# Altium project EL-04 Data Logger.PrjPcb
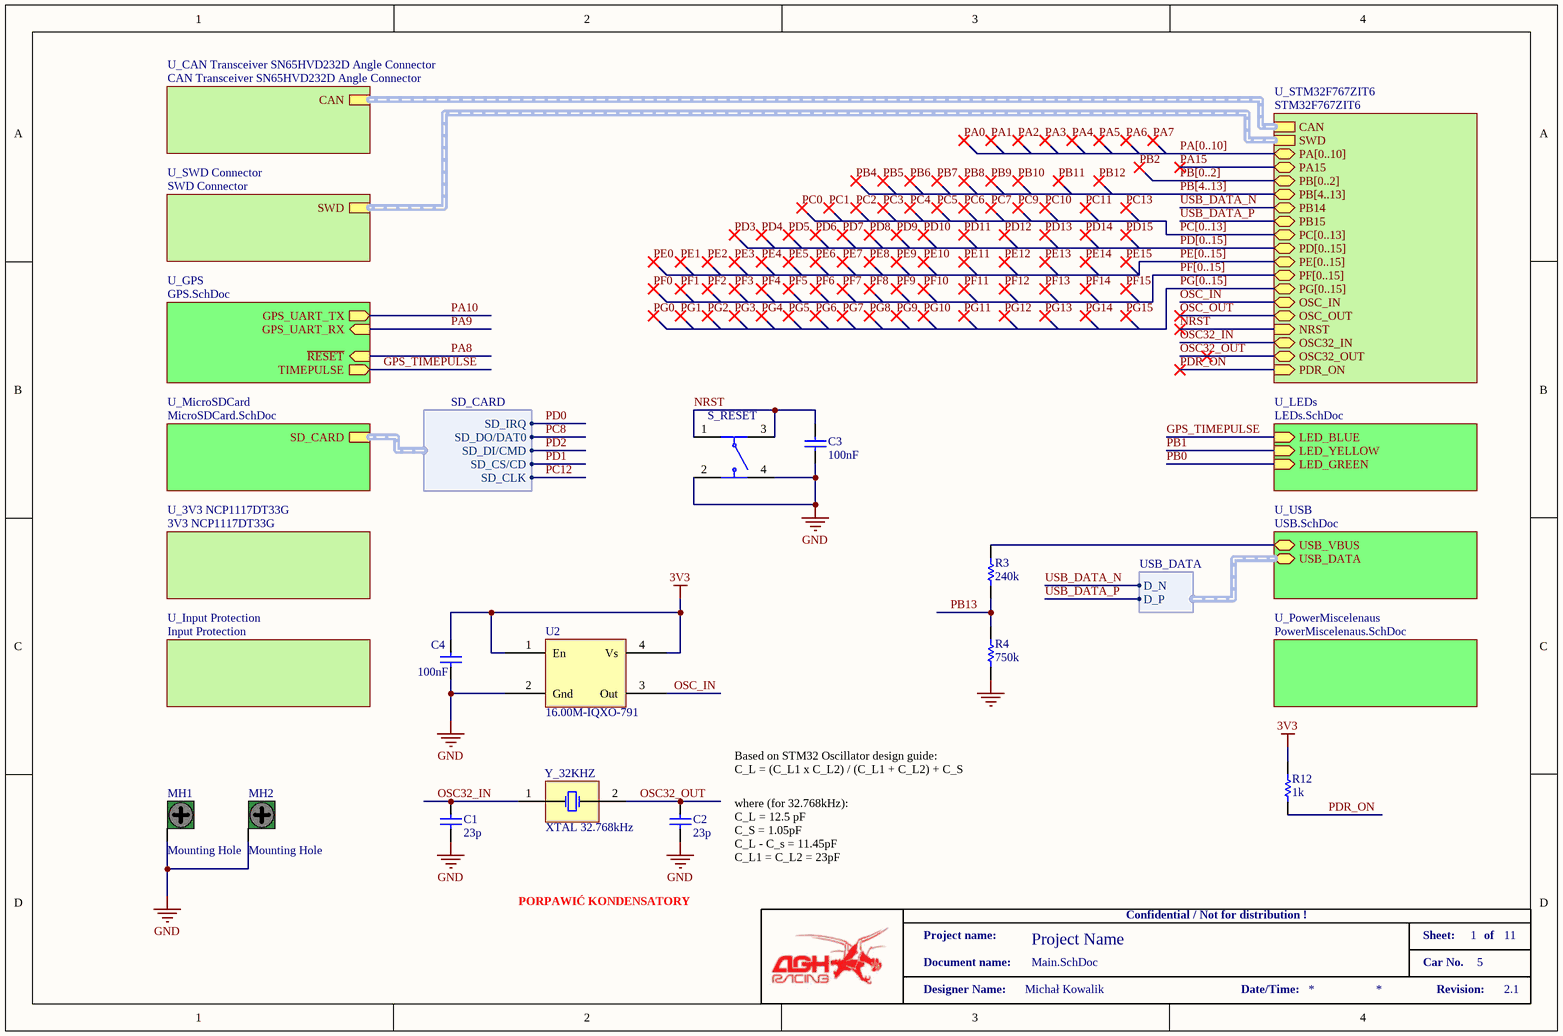
[diagram p0: Main.SchDoc]
3 sheets, 26 parts. Net scope: hierarchical (ports join the sheet entries above them; power ports are global).
Board file: PCB1.PcbDoc
Sheets:
  Main.SchDoc
    U_GPS = GPS.SchDoc
    U_MicroSDCard = MicroSDCard.SchDoc

## Sheet Main.SchDoc
size A4; Author: Michał Kowalik; CompanyName: AGH Racing; DocumentNumber: 1; Revision: 2.1; SheetNumber: 1; SheetTotal: 11; CarNumber: 5; ProjectName: Project Name

### Parts
C1  value 23p  [CAP_0603_IPC_MD]  (hidden comment: Cap)
C2  value 23p  [CAP_0603_IPC_MD]  (hidden comment: Cap)
C3  value 100nF  [CAP_0603_IPC_MD]  (hidden comment: Cap)
C4  value 100nF  [CAP_0603_IPC_MD]  (hidden comment: Cap)
MH1  Mounting Hole  [MOUNTING HOLE 2mm]  (no BOM)
MH2  Mounting Hole  [MOUNTING HOLE 2mm]  (no BOM)
R3  value 240k  [RES_0603_IPC_MD]  (hidden comment: Res)
R4  value 750k  [RES_0603_IPC_MD]  (hidden comment: Res)
R12  value 1k  [RES_0603_IPC_MD]  (hidden comment: Res)
S_RESET  Switch  [Microswitch_SMD_4_3mm]  (value not drawn)
U2  16.00M-IQXO-791  [ICLCX18]
Y_32KHZ  XTAL 32.768kHz  [XTAL 32.768kHz IQD Frequencies]

### Sub-sheets
U_3V3 NCP1117DT33G = 3V3 NCP1117DT33G (file not in this document): no entries
U_CAN Transceiver SN65HVD232D Angle Connector = CAN Transceiver SN65HVD232D Angle Connector (file not in this document): CAN (harness CAN)
U_GPS = GPS.SchDoc: ~{RESET} (in), TIMEPULSE (out), GPS_UART_RX (in), GPS_UART_TX (out)
U_Input Protection = Input Protection (file not in this document): no entries
U_LEDs = LEDs.SchDoc (file not in this document): LED_BLUE (in), LED_YELLOW (in), LED_GREEN (in)
U_MicroSDCard = MicroSDCard.SchDoc: SD_CARD (harness SD_CARD)
U_PowerMiscelenaus = PowerMiscelenaus.SchDoc (file not in this document): no entries
U_STM32F767ZIT6 = STM32F767ZIT6 (file not in this document): CAN (harness CAN), SWD (harness SWD), PB[0..2] (bidir), PB[4..13] (bidir), PC[0..13] (bidir), PA15 (bidir), OSC_IN (bidir), OSC_OUT (bidir), NRST (in), OSC32_IN (bidir), OSC32_OUT (bidir), PDR_ON (in), PD[0..15] (bidir), PE[0..15] (bidir), PF[0..15] (bidir), PG[0..15] (bidir), PB14 (bidir), PB15 (bidir), PA[0..10] (bidir)
U_SWD Connector = SWD Connector (file not in this document): SWD (harness SWD)
U_USB = USB.SchDoc (file not in this document): USB_DATA (bidir, harness USB_DATA), USB_VBUS (bidir)

### Harnesses
SD_CARD: SD_CLK, SD_CS/CD, SD_DI/CMD, SD_DO/DAT0, SD_IRQ
USB_DATA: D_N, D_P

### Nets
3V3: C4.2 R12.2 U2.1(En) U2.4(Vs)
GND: C1.1 C2.1 C3.1 C4.1 MH1.MOUNTING MH2.MOUNTING R4.1 S_RESET.2 S_RESET.4 U2.2(Gnd)
GPS_TIMEPULSE: sheet U_GPS/TIMEPULSE, sheet U_LEDs/LED_BLUE
NRST: C3.2 S_RESET.1 S_RESET.3 ; sheet U_STM32F767ZIT6/NRST
OSC32_IN: C1.2 Y_32KHZ.1(OSC1) ; sheet U_STM32F767ZIT6/OSC32_IN
OSC32_OUT: C2.2 Y_32KHZ.2(OSC2) ; sheet U_STM32F767ZIT6/OSC32_OUT
OSC_IN: U2.3(Out) ; sheet U_STM32F767ZIT6/OSC_IN
OSC_OUT: sheet U_STM32F767ZIT6/OSC_OUT
PA8: sheet U_GPS/~{RESET}
PA9: sheet U_GPS/GPS_UART_RX
PA10: sheet U_GPS/GPS_UART_TX
PA15: sheet U_STM32F767ZIT6/PA15
PB0: sheet U_LEDs/LED_GREEN
PB1: sheet U_LEDs/LED_YELLOW
PB13: R3.1 R4.2
PDR_ON: R12.1 ; sheet U_STM32F767ZIT6/PDR_ON
USB_DATA_N: sheet U_STM32F767ZIT6/PB14, sheet U_USB/USB_DATA.D_N
USB_DATA_P: sheet U_STM32F767ZIT6/PB15, sheet U_USB/USB_DATA.D_P
NetR3_2: R3.2 ; sheet U_USB/USB_VBUS

### Buses and harness runs
bus PA[0..10] = sheet U_STM32F767ZIT6/PA[0..10]
bus PB[0..2] = sheet U_STM32F767ZIT6/PB[0..2]
bus PB[4..13] = sheet U_STM32F767ZIT6/PB[4..13]
bus PC[0..13] = sheet U_STM32F767ZIT6/PC[0..13]
bus PD[0..15] = sheet U_STM32F767ZIT6/PD[0..15]
bus PE[0..15] = sheet U_STM32F767ZIT6/PE[0..15]
bus PF[0..15] = sheet U_STM32F767ZIT6/PF[0..15]
bus PG[0..15] = sheet U_STM32F767ZIT6/PG[0..15]
harness sheet U_CAN Transceiver SN65HVD232D Angle Connector/CAN = sheet U_STM32F767ZIT6/CAN
harness sheet U_STM32F767ZIT6/SWD = sheet U_SWD Connector/SWD

### Notes on the sheet
- Based on STM32 Oscillator design guide:
  C_L = (C_L1 x C_L2) / (C_L1 + C_L2) + C_S
- PORPAWIĆ KONDENSATORY
- where (for 32.768kHz):
  C_L = 12.5 pF
  C_S = 1.05pF
  C_L - C_s = 11.45pF
  C_L1 = C_L2 = 23pF
- Confidential / Not for distribution !
- Project name:
- Document name:
- Sheet:
- Car No.
- of
- Designer Name:
- Date/Time:
- Revision:
- Labels drawn without touching a wire or pin: PA0, PA1, PA2, PA3, PA5, PA6, PA7, PB2, PB4, PB5, PB6, PB7, PB8, PB9, PB10, PB11, PB12, PC0, PC1, PC2, PC3, PC4, PC5, PC6, PC7, PC9, PC10, PC13, PD3, PD4, PD5, PD6, PD7, PD8, PD9, PD10, PD11, PD12, PD13, PD14, PD15, PE0, PE1, PE2, PE3, PE4, PE5, PE6, PE7, PE8, PE9, PE10, PE11, PE12, PE13, PE14, PE15, PF0, PF1, PF2, PF3, PF4, PF5, PF6, PF7, PF8, PF9, PF10, PF11, PF12, PF13, PF14, PF15, PG0, PG1, PG2, PG3, PG4, PG5, PG6, PG7, PG8, PG9, PG10, PG11, PG12, PG13, PG14, PG15

### Library data of the parts
C1-C4 = Cap: Capacitor
R3 R4 R12 = Res: Resistor
S_RESET = Microswitch
U2 = 16.00M-IQXO-791: Crystal Clock Oscillator; Manufacturer: IQD FREQUENCY PRODUCTS; MPN: LFSPXO066657CUTT; Supplier: TME; SPN: 16.00M-IQXO-791; Name: 16.00M-IQXO-791
Y_32KHZ = XTAL 32.768kHz 2-pin: Crystal Oscillator 32.768kHz; Manufacturer: IQD FREQUENCY PRODUCTS; Manufacturer Symbol: 32.768K-CFPX217; Spplier Symbol: 32.768K-85SMXR; Supplier: TME

## Sheet GPS.SchDoc
size A4; Author: Author; CompanyName: AGH Racing; DocumentNumber: 2; Revision: Rev; SheetNumber: 3; SheetTotal: 8; CarNumber: 5; ProjectName: Project Name
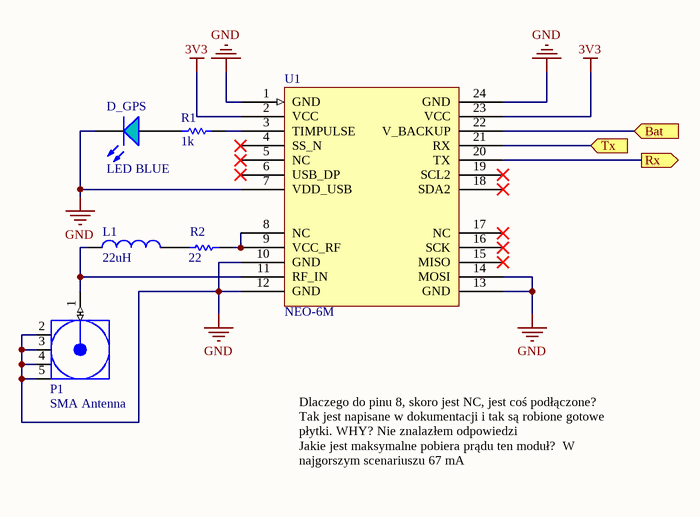
[diagram p1: GPS.SchDoc]

### Parts
D_GPS  LED BLUE  [KPA_2106]
L1  value 22uH  [IND_0603_IPC_HD]  (hidden comment: Ind)
P1  SMA Antenna  [SMA_PCB_Female_Angle_connector]
R1  value 1k  [RES_0603_IPC_HD]  (hidden comment: Res)
R2  value 22  [RES_0603_IPC_HD]  (hidden comment: Res)
U1  NEO-6M  [NEO-6M]

### Ports
Bat (in), Rx (out), Tx (in)

### Nets
3V3: U1.2(VCC) U1.23(VCC)
GND: D_GPS.2(K) P1.2(GND) P1.3(GND) P1.4(GND) P1.5(GND) U1.1(GND) U1.7(VDD_USB) U1.10(GND) U1.12(GND) U1.13(GND) U1.14(MOSI) U1.24(GND)
NetD_GPS_1: D_GPS.1(A) R1.1
NetL1_1: L1.1 P1.1(Signal) U1.11(RF_IN)
NetL1_2: L1.2 R2.1
NetR1_2: R1.2 U1.3(TIMPULSE)
NetR2_2: R2.2 U1.8(NC) U1.9(VCC_RF)
NetU1_20: U1.20(TX) ; port Rx
NetU1_21: U1.21(RX) ; port Tx
NetU1_22: U1.22(V_BACKUP) ; port Bat

Not connected (* = marked no-connect by the designer): U1 4(SS_N)* 5(NC)* 6(USB_DP)* 15(MISO)* 16(SCK)* 17(NC)* 18(SDA2)* 19(SCL2)*

### Notes on the sheet
- Dlaczego do pinu 8, skoro jest NC, jest coś podłączone? Tak jest napisane w dokumentacji i tak są robione gotowe płytki. WHY? Nie znalazłem odpowiedzi
  Jakie jest maksymalne pobiera prądu ten moduł?  W najgorszym scenariuszu 67 mA
- Confidential / Not for distribution !
- Project name:
- Document name:
- Sheet:
- Car No.
- of
- Designer Name:
- Date/Time:
- Revision:

### Library data of the parts
L1 = Ind: Inductor
P1 = SMA PCB Female Antenna Angle connector: Gniazdo; SMA; żeńskie; kątowe 90°; 50Ω; THT; na PCB; teflon; złocony; Manufaturer: TE CONNECTIVITY; Manufacturer Symbol: 5-1814400-1; Supplier: TME; Supplier Symbol: 5-1814400-1
R1 R2 = Res: Resistor

## Sheet MicroSDCard.SchDoc
size A4; Author: Michał Kowalik; CompanyName: AGH Racing; DocumentNumber: 2; Revision: 2.1; SheetNumber: 2; SheetTotal: 11; CarNumber: 5; ProjectName: Project Name
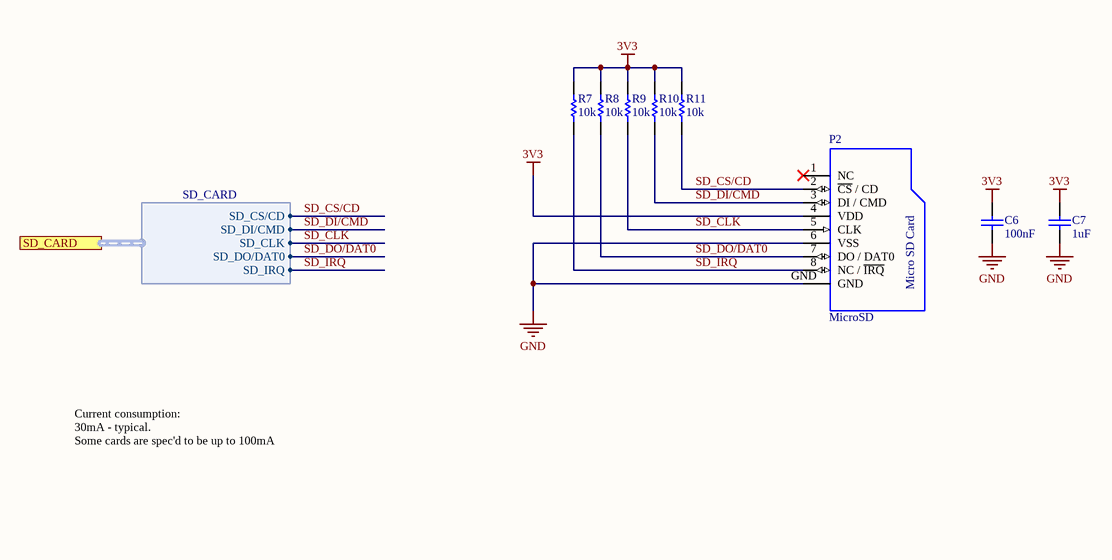
[diagram p2: MicroSDCard.SchDoc]

### Parts
C6  value 100nF  [CAP_0603_IPC_MD]  (hidden comment: Cap)
C7  value 1uF  [CAP_0603_IPC_MD]  (hidden comment: Cap)
P2  MicroSD  [MICROSDCARD_SOCKET]
R7  value 10k  [RES_0603_IPC_MD]  (hidden comment: Res)
R8  value 10k  [RES_0603_IPC_MD]  (hidden comment: Res)
R9  value 10k  [RES_0603_IPC_MD]  (hidden comment: Res)
R10  value 10k  [RES_0603_IPC_MD]  (hidden comment: Res)
R11  value 10k  [RES_0603_IPC_MD]  (hidden comment: Res)

### Ports
SD_CARD (harness SD_CARD)

### Harnesses
SD_CARD: SD_CS/CD, SD_DI/CMD, SD_CLK, SD_DO/DAT0, SD_IRQ

### Nets
3V3: C6.2 C7.2 P2.4(VDD) R7.2 R8.2 R9.2 R10.2 R11.2
GND: C6.1 C7.1 P2.6(VSS) P2.GND
SD_CLK: P2.5(CLK) R9.1 ; port SD_CARD.SD_CLK  [project net PC12]
SD_CS/CD: P2.2(~{CS}_/_CD) R11.1 ; port SD_CARD.SD_CS/CD  [project net PD1]
SD_DI/CMD: P2.3(DI_/_CMD) R10.1 ; port SD_CARD.SD_DI/CMD  [project net PD2]
SD_DO/DAT0: P2.7(DO_/_DAT0) R8.1 ; port SD_CARD.SD_DO/DAT0  [project net PC8]
SD_IRQ: P2.8(NC_/_~{IRQ}) R7.1 ; port SD_CARD.SD_IRQ  [project net PD0]

Not connected (* = marked no-connect by the designer): P2 1(NC)*

### Notes on the sheet
- Current consumption:
  30mA - typical.
  Some cards are spec'd to be up to 100mA
- Confidential / Not for distribution !
- Project name:
- Document name:
- Sheet:
- Car No.
- of
- Designer Name:
- Date/Time:
- Revision:
- (in symbol MicroSD) Micro SD Card

### Library data of the parts
C6 C7 = Cap: Capacitor
P2 = MicroSD: Micro SD Card Connector
R7-R11 = Res: Resistor

## Nets that join several sheets
3V3: Main (C4.2 R12.2 U2.1 U2.4), GPS (U1.2 U1.23), MicroSDCard (8 pins)
GND: Main (10 pins), GPS (12 pins), MicroSDCard (C6.1 C7.1 P2.6 P2.GND)